# EAGLE schematic Board (EAGLE 6.3)
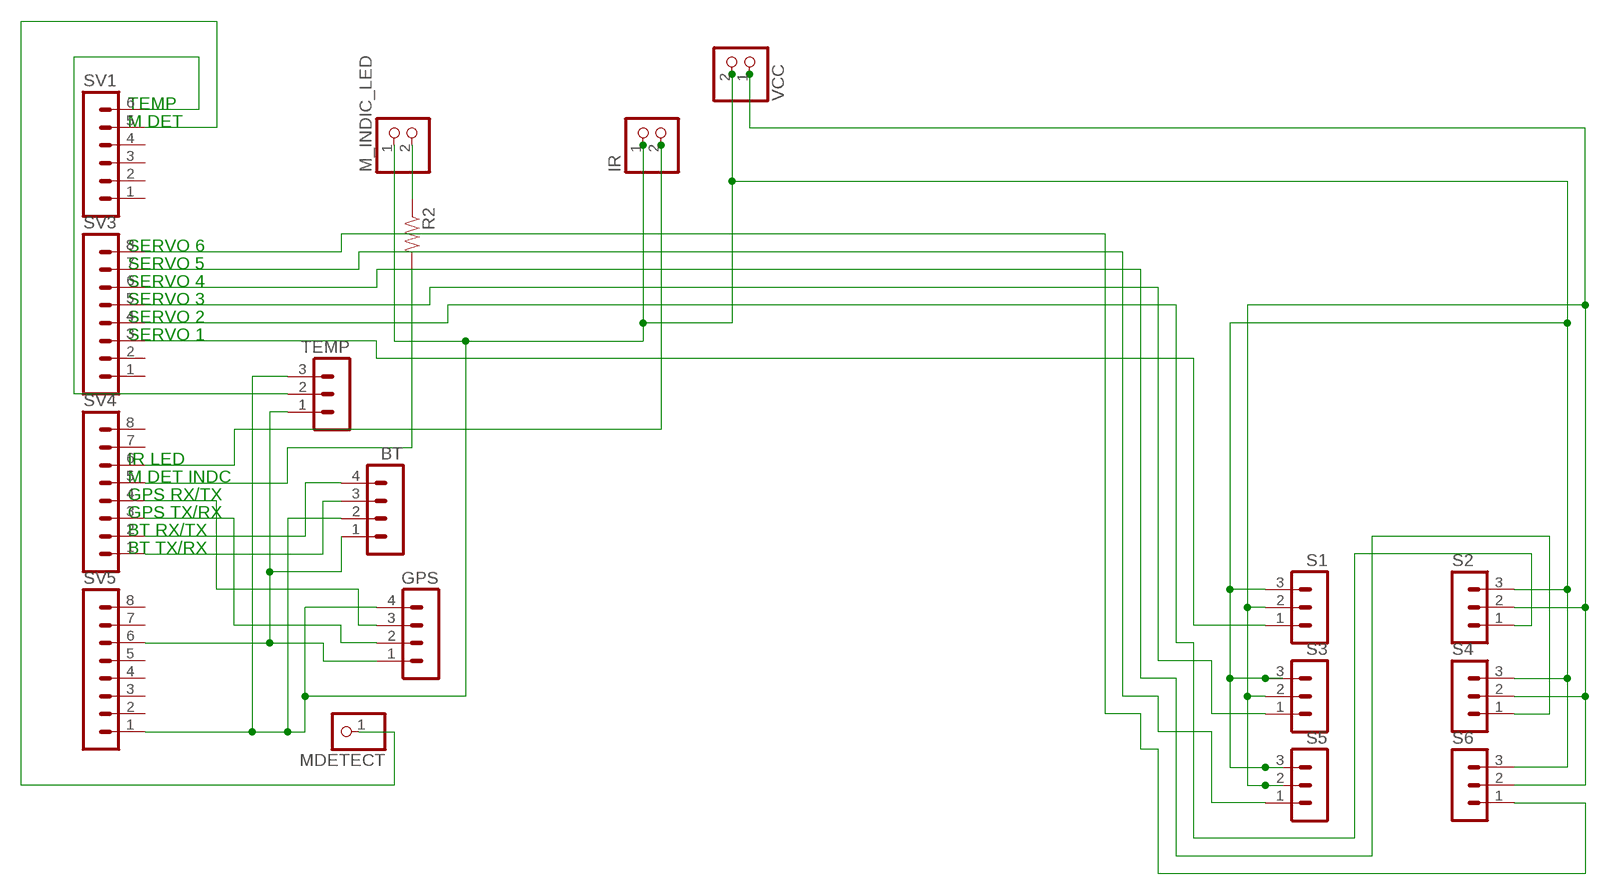
[diagram p0: schematic, sheet 1]

## Parts
BT  MA04-1  [MA04-1]
GPS  MA04-1  [MA04-1]
IR  PINHD-1X2  [1X02]
M_INDIC_LED  PINHD-1X2  [1X02]
MDETECT  PINHD-1X1  [1X01]
R2  RESISTORAXIAL-0.3  [AXIAL-0.3]
S1  MA03-1  [MA03-1]
S2  MA03-1  [MA03-1]
S3  MA03-1  [MA03-1]
S4  MA03-1  [MA03-1]
S5  MA03-1  [MA03-1]
S6  MA03-1  [MA03-1]
SV1  MA06-1  [MA06-1]
SV3  MA08-1  [MA08-1]
SV4  MA08-1  [MA08-1]
SV5  MA08-1  [MA08-1]
TEMP  MA03-1  [MA03-1]
VCC  PINHD-1X2  [1X02]

## Nets
N$1: S1.1 SV3.3
N$2: BT.1 GPS.1 SV5.6 TEMP.1
N$4: S2.1 SV3.4
N$5: S3.1 SV3.5
N$6: S4.1 SV3.6
N$7: S5.1 SV3.7
N$8: S6.1 SV3.8
N$9: BT.2 GPS.4 IR.1 M_INDIC_LED.1 S1.3 S2.3 S3.3 S4.3 S5.3 S6.3 SV5.1 TEMP.3 VCC.2
N$11: SV1.6 TEMP.2
N$12: BT.4 SV4.2
N$13: MDETECT.1 SV1.5
N$14: M_INDIC_LED.2 R2.P$1
N$15: S1.2 S2.2 S3.2 S4.2 S5.2 S6.2 VCC.1
N$18: R2.P$2 SV4.5
N$19: IR.2 SV4.6
N$24: BT.3 SV4.1
N$25: GPS.2 SV4.3
N$26: GPS.3 SV4.4
Unconnected: SV1.1 SV1.2 SV1.3 SV1.4 SV3.1 SV3.2 SV4.7 SV4.8 SV5.2 SV5.3 SV5.4 SV5.5 SV5.7 SV5.8

## Notes on the sheet
- TEMP
- M DET
- SERVO 6
- SERVO 5
- SERVO 4
- SERVO 3
- SERVO 2
- SERVO 1
- IR LED
- M DET INDC
- GPS RX/TX
- GPS TX/RX
- BT RX/TX
- BT TX/RX

## Library data of the parts
BT GPS = con-lstb:MA04-1: PIN HEADER; OC_FARNELL: unknown; OC_NEWARK: unknown
IR M_INDIC_LED VCC = pinhead:PINHD-1X2: PIN HEADER
MDETECT = pinhead:PINHD-1X1: PIN HEADER
R2 = SparkFun-Passives:RESISTOR: Resistor Basic schematic elements and footprints for 0603, 1206, and PTH resistors.
S1-S6 TEMP = con-lstb:MA03-1: PIN HEADER; OC_FARNELL: unknown; OC_NEWARK: unknown
SV1 = con-lstb:MA06-1: PIN HEADER; OC_FARNELL: unknown; OC_NEWARK: unknown
SV3-SV5 = con-lstb:MA08-1: PIN HEADER; OC_FARNELL: unknown; OC_NEWARK: unknown